# EAGLE design CubePCB_powerControl (EAGLE 9.2.2)
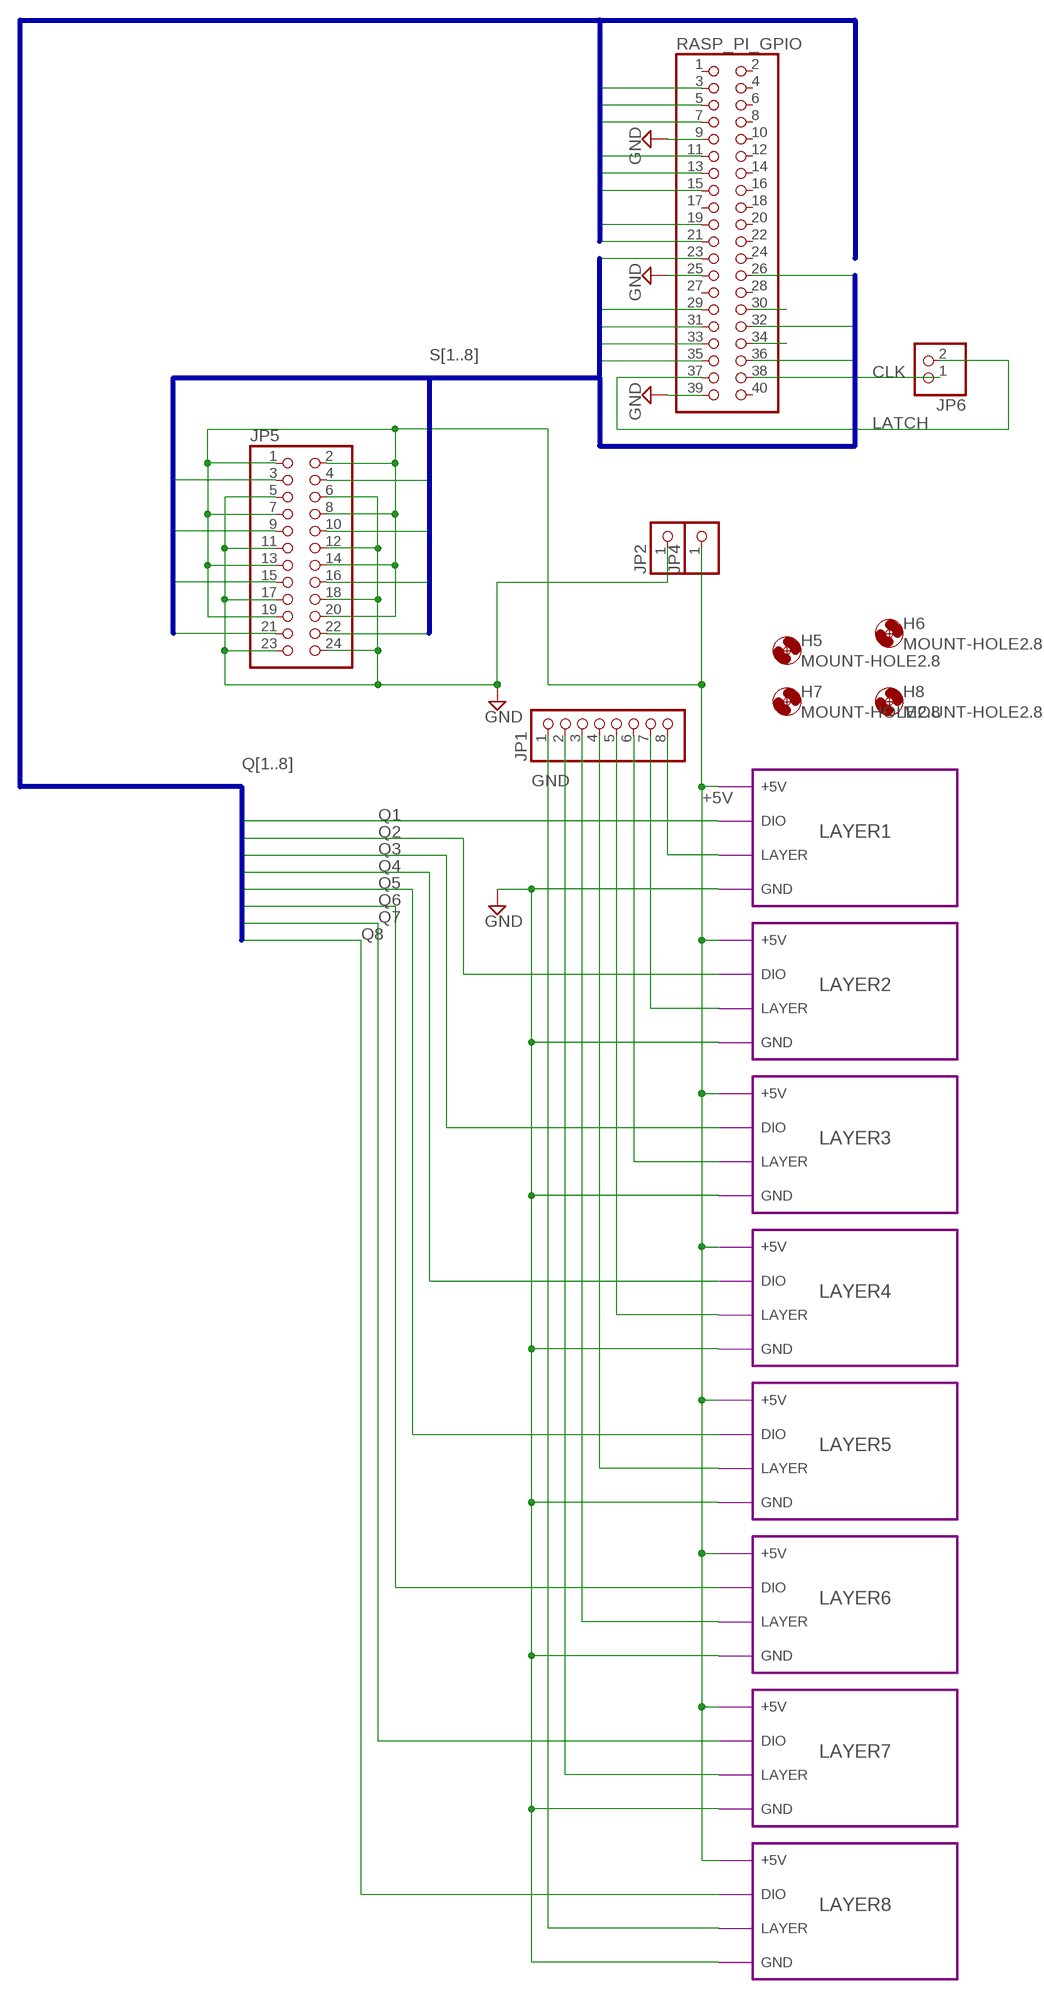
[diagram p0: schematic, sheet 1]

## Parts
H5  MOUNT-HOLE2.8  [2,8]
H6  MOUNT-HOLE2.8  [2,8]
H7  MOUNT-HOLE2.8  [2,8]
H8  MOUNT-HOLE2.8  [2,8]
JP1  PINHD-1X8  [1X08]
JP2  PINHD-1X1  [1X01]
JP4  PINHD-1X1  [1X01]
JP5  PINHD-2X12  [2X12]
JP6  PINHD-1X2  [1X02]
RASP_PI_GPIO  PINHD-2X20  [2X20]

## Module instances
LAYER1 = LAYER
LAYER2 = LAYER
LAYER3 = LAYER
LAYER4 = LAYER
LAYER5 = LAYER
LAYER6 = LAYER
LAYER7 = LAYER
LAYER8 = LAYER

## Nets
+5V: JP4.1 JP5.1 JP5.2 JP5.7 JP5.8 JP5.13 JP5.14 JP5.19 JP5.20 ; port LAYER1.+5V LAYER2.+5V LAYER3.+5V LAYER4.+5V LAYER5.+5V LAYER6.+5V LAYER7.+5V LAYER8.+5V
CLK: JP6.1 RASP_PI_GPIO.38
GND: JP2.1 JP5.5 JP5.6 JP5.11 JP5.12 JP5.17 JP5.18 JP5.23 JP5.24 RASP_PI_GPIO.9 RASP_PI_GPIO.25 RASP_PI_GPIO.39 ; port LAYER8.GND LAYER7.GND LAYER6.GND LAYER5.GND LAYER4.GND LAYER3.GND LAYER2.GND LAYER1.GND
L1: JP1.8 ; port LAYER1.LAYER
L2: JP1.7 ; port LAYER2.LAYER
L3: JP1.6 ; port LAYER3.LAYER
L4: JP1.5 ; port LAYER4.LAYER
L5: JP1.4 ; port LAYER5.LAYER
L6: JP1.3 ; port LAYER6.LAYER
L7: JP1.2 ; port LAYER7.LAYER
L8: JP1.1 ; port LAYER8.LAYER
LATCH: JP6.2 RASP_PI_GPIO.37
N$4: RASP_PI_GPIO.30
N$5: RASP_PI_GPIO.34
Q1: RASP_PI_GPIO.3 ; port LAYER1.DIO
Q2: RASP_PI_GPIO.5 ; port LAYER2.DIO
Q3: RASP_PI_GPIO.7 ; port LAYER3.DIO
Q4: RASP_PI_GPIO.11 ; port LAYER4.DIO
Q5: RASP_PI_GPIO.13 ; port LAYER5.DIO
Q6: RASP_PI_GPIO.15 ; port LAYER6.DIO
Q7: RASP_PI_GPIO.19 ; port LAYER7.DIO
Q8: RASP_PI_GPIO.21 ; port LAYER8.DIO
S1: JP5.3 RASP_PI_GPIO.35
S2: JP5.4 RASP_PI_GPIO.36
S3: JP5.9 RASP_PI_GPIO.32
S4: JP5.10 RASP_PI_GPIO.33
S5: JP5.15 RASP_PI_GPIO.29
S6: JP5.16 RASP_PI_GPIO.31
S7: JP5.21 RASP_PI_GPIO.23
S8: JP5.22 RASP_PI_GPIO.26
Unconnected: RASP_PI_GPIO.1 RASP_PI_GPIO.2 RASP_PI_GPIO.4 RASP_PI_GPIO.6 RASP_PI_GPIO.8 RASP_PI_GPIO.10 RASP_PI_GPIO.12 RASP_PI_GPIO.14 RASP_PI_GPIO.16 RASP_PI_GPIO.17 RASP_PI_GPIO.18 RASP_PI_GPIO.20 RASP_PI_GPIO.22 RASP_PI_GPIO.24 RASP_PI_GPIO.27 RASP_PI_GPIO.28 RASP_PI_GPIO.40

## Buses
Q[1..8]
S[1..8]

## Library data of the parts
H5-H8 = holes:MOUNT-HOLE: MOUNTING HOLE with drill center marker
JP1 = pinhead:PINHD-1X8: PIN HEADER
JP2 JP4 = pinhead:PINHD-1X1: PIN HEADER
JP5 = pinhead:PINHD-2X12: PIN HEADER
JP6 = pinhead:PINHD-1X2: PIN HEADER
RASP_PI_GPIO = pinhead:PINHD-2X20: PIN HEADER

## Module LAYER
Ports: +5V(io) DIO(io) LAYER(io) GND(io)
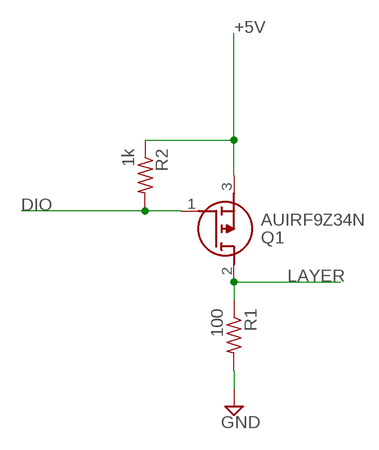
[diagram p1: schematic, module LAYER, sheet 1]

### Parts
Q1  AUIRF9Z34N  [TO254P482X1016X2192-3P]
R1  100  R-US_0204/7  [0204/7]
R2  1k  R-US_0204/7  [0204/7]

### Nets
+5V: Q1.3(S) R2.1
DIO: Q1.1(G) R2.2
GND: R1.2
LAYER: Q1.2(D) R1.1

### Library data of the parts
Q1 = AUIRF9Z34N:AUIRF9Z34N: MOSFET P-Channel 55V 19A TO220AB Infineon AUIRF9Z34N P-channel MOSFET Transistor, 19 A, 55 V, 3-Pin TO-220AB Source: Datasheet <https://www.infineon.com/dgdl/auirf9z34n.pdf?fileId=5546d462533600a4015355b0fd23141c>; ALLIED_NUMBER: 70411560; ALLIED_PRICE-STOCK: https://www.alliedelec.com/infineon-auirf9z34n/70411560/; ARROW_PART_NUMBER: AUIRF9Z34N; ARROW_PRICE-STOCK: https://www.arrow.com/en/products/auirf9z34n/infineon-technologies-ag; DESCRIPTION: MOSFET P-Channel 55V 19A TO220AB Infineon AUIRF9Z34N P-channel MOSFET Transistor, 19 A, 55 V, 3-Pin TO-220AB; HEIGHT: 4.82mm; MANUFACTURER_NAME: Infineon; MANUFACTURER_PART_NUMBER: AUIRF9Z34N; RS_PART_NUMBER: 7481803P; RS_PRICE-STOCK: http://uk.rs-online.com/web/p/products/7481803P
R1 R2 = rcl:R-US_: RESISTOR, American symbol; SPICEPREFIX: R

## Board
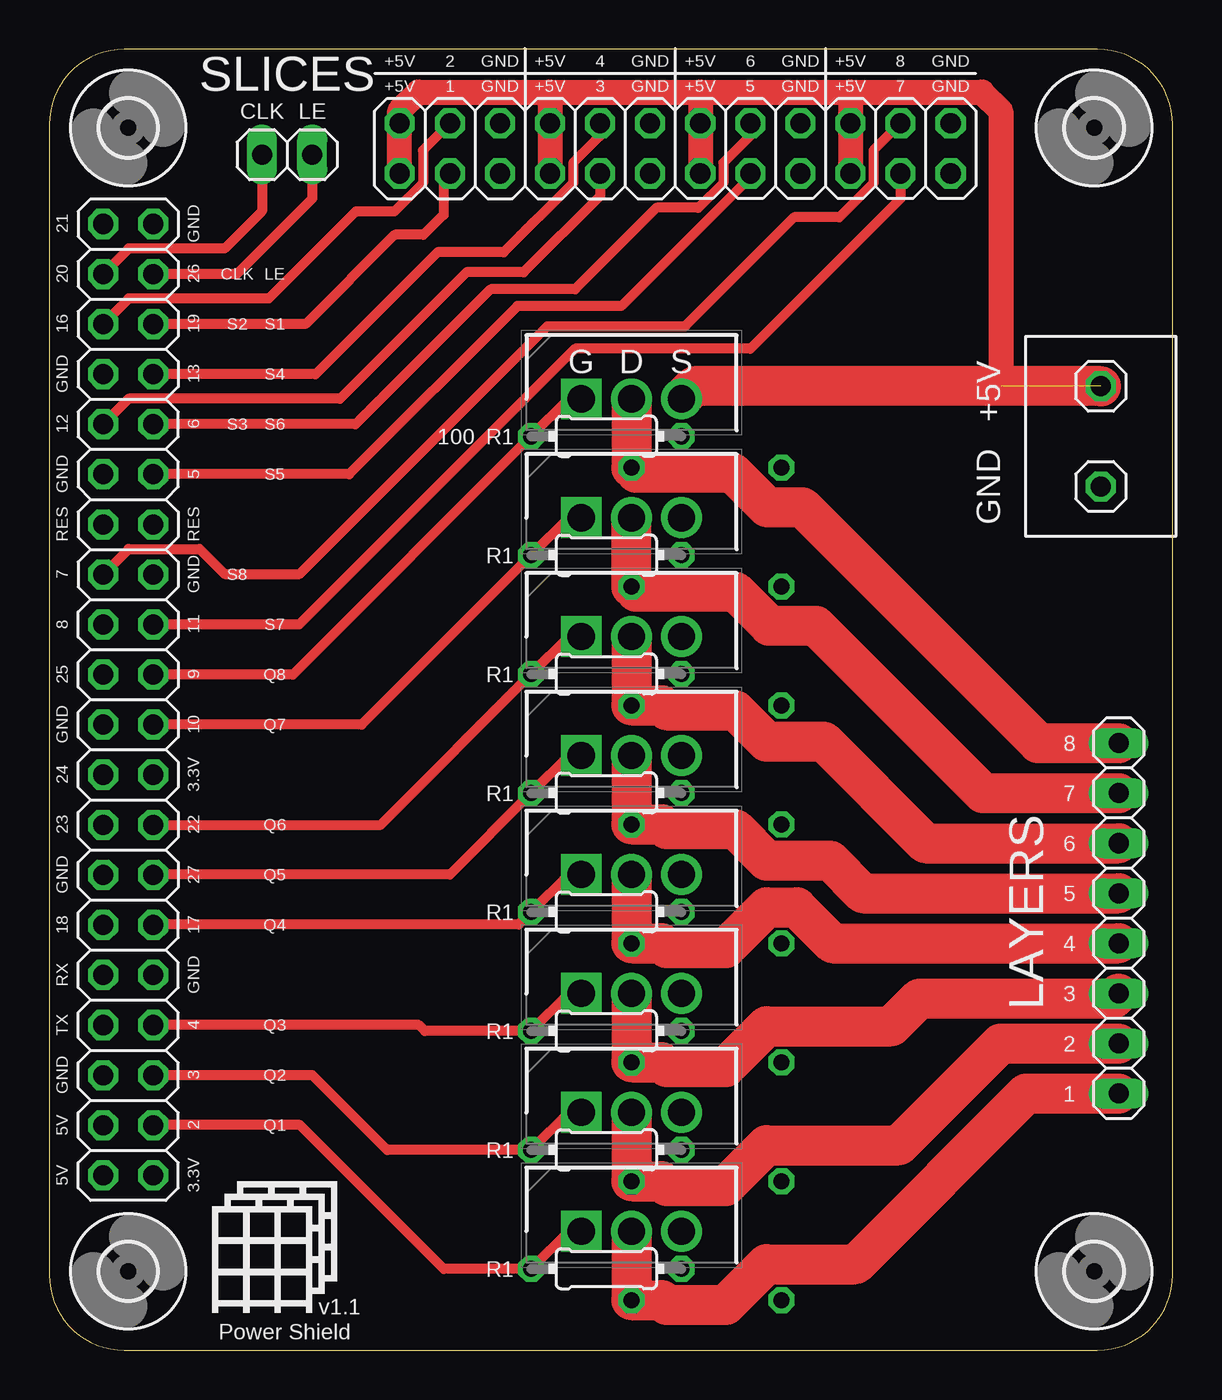
[diagram p2: board, top side]
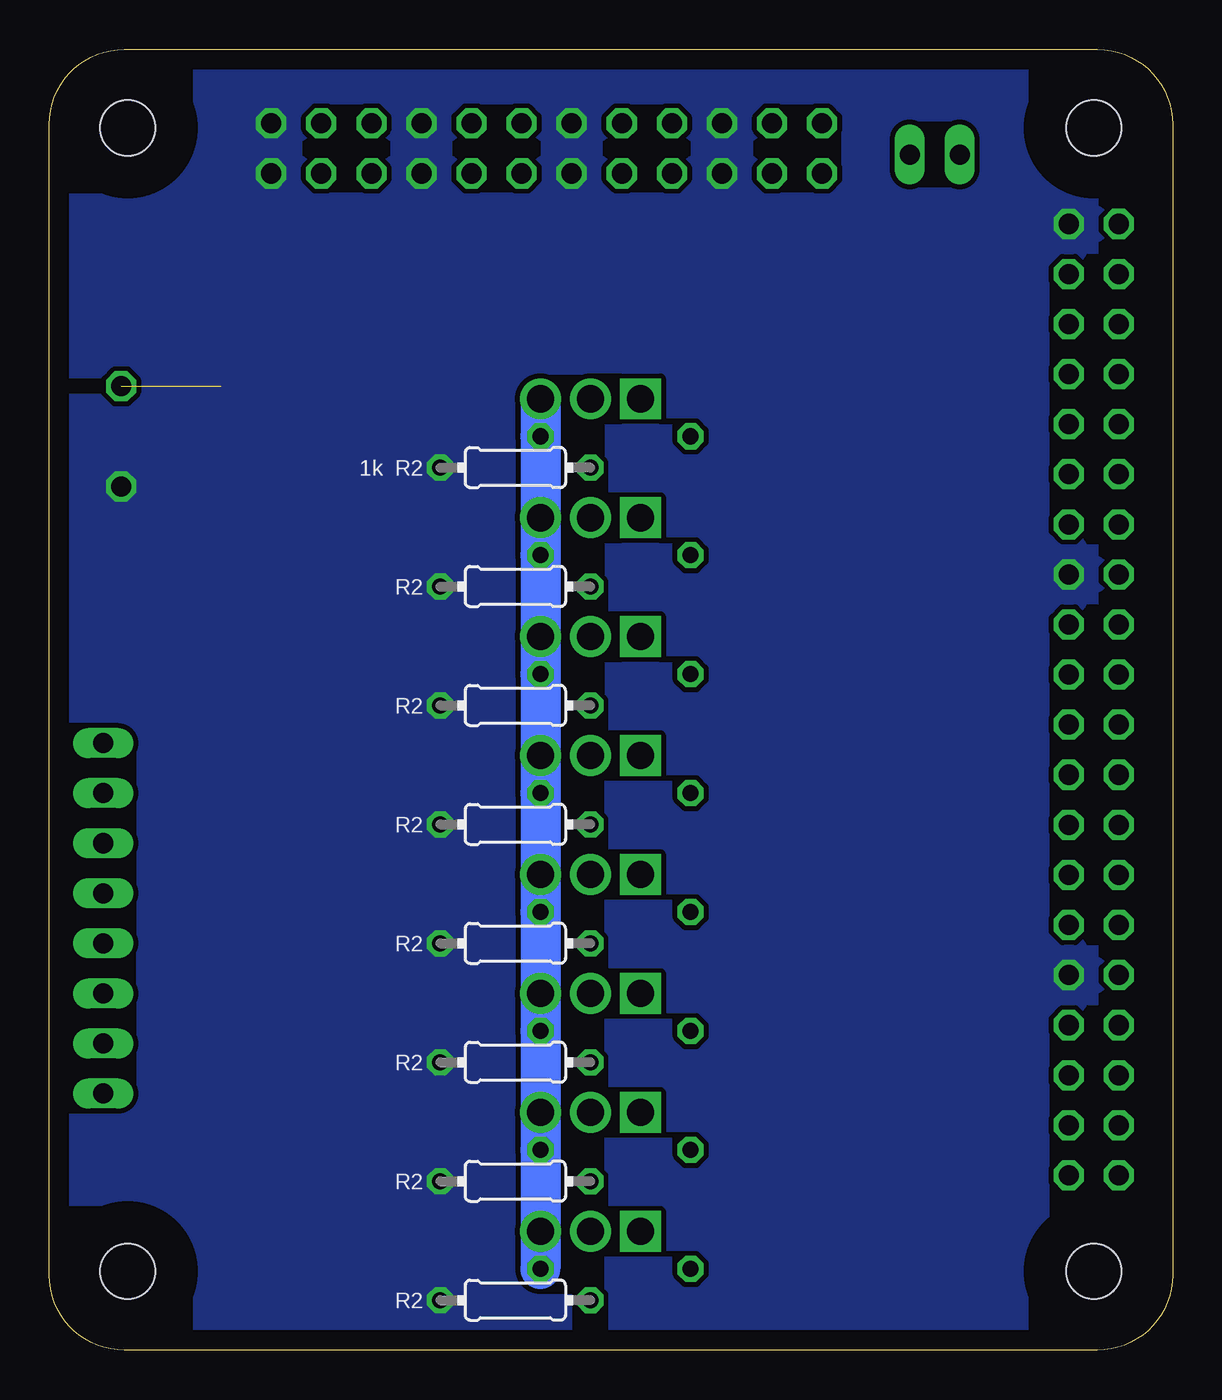
[diagram p3: board, bottom side, seen from below]

Size 56.98 x 65.99 mm. Coordinates in mm from the lower left corner, seen from the top.
Outline: 0,62.18 0,3.81 arc90 3.81,0 53.17,0 arc90 56.98,3.81 56.98,62.18 arc90 53.17,65.99 3.81,65.99 arc90 0,62.18
Copper layers (1*16): Top 0.034796875mm / dielectric 1.5mm / Bottom 0.034796875mm
Design rules "default *": minimum track width 20mil, minimum drill 0.35mm, track to track 10mil, track to pad 6mil, pad to pad 6mil, via to via 6mil, smd to smd 6mil, copper to edge 40mil, drill to drill 6mil, minimum pad ring 10mil, minimum via ring 8mil, stop-mask expansion 4mil, vias tented up to drill 0mil, thermal gap 10mil

### Footprints (pad centres in the part's own frame; a part is rotated, then mirrored left to right if it is on the bottom)
2,8 = hole 2.8: 0,0
1X08 = drill 1.016 long: 1 -8.89,0; 2 -6.35,0; 3 -3.81,0; 4 -1.27,0; 5 1.27,0; 6 3.81,0; 7 6.35,0; 8 8.89,0
1X01 = drill 1.016 octagon: 1 0,0
2X12 = drill 1.016 octagon: 1 -13.97,-1.27; 2 -13.97,1.27; 3 -11.43,-1.27; 4 -11.43,1.27; 5 -8.89,-1.27; 6 -8.89,1.27; 7 -6.35,-1.27; 8 -6.35,1.27; 9 -3.81,-1.27; 10 -3.81,1.27; 11 -1.27,-1.27; 12 -1.27,1.27; 13 1.27,-1.27; 14 1.27,1.27; 15 3.81,-1.27; 16 3.81,1.27; 17 6.35,-1.27; 18 6.35,1.27; 19 8.89,-1.27; 20 8.89,1.27; 21 11.43,-1.27; 22 11.43,1.27; 23 13.97,-1.27; 24 13.97,1.27
1X02 = drill 1.016 long: 1 -1.27,0; 2 1.27,0
TO254P482X1016X2192-3P = drill 1.38 pad 2.07 square: 1 0,0 | drill 1.38 pad 2.07: 2 2.54,0; 3 5.08,0
0204/7 = drill 0.813 octagon: 1 -3.81,0; 2 3.81,0
2X20 = drill 1.016 octagon: 1 -24.13,-1.27; 2 -24.13,1.27; 3 -21.59,-1.27; 4 -21.59,1.27; 5 -19.05,-1.27; 6 -19.05,1.27; 7 -16.51,-1.27; 8 -16.51,1.27; 9 -13.97,-1.27; 10 -13.97,1.27; 11 -11.43,-1.27; 12 -11.43,1.27; 13 -8.89,-1.27; 14 -8.89,1.27; 15 -6.35,-1.27; 16 -6.35,1.27; 17 -3.81,-1.27; 18 -3.81,1.27; 19 -1.27,-1.27; 20 -1.27,1.27; 21 1.27,-1.27; 22 1.27,1.27; 23 3.81,-1.27; 24 3.81,1.27; 25 6.35,-1.27; 26 6.35,1.27; 27 8.89,-1.27; 28 8.89,1.27; 29 11.43,-1.27; 30 11.43,1.27; 31 13.97,-1.27; 32 13.97,1.27; 33 16.51,-1.27; 34 16.51,1.27; 35 19.05,-1.27; 36 19.05,1.27; 37 21.59,-1.27; 38 21.59,1.27; 39 24.13,-1.27; 40 24.13,1.27

### Placement (x,y rotation side)
H5  4,62 0 top
H6  4,4 0 top
H7  53,62 0 top
H8  53,4 0 top
JP1  54.24,21.91 270 top
JP2  53.34,43.81 0 top
JP4  53.34,48.9 0 top
JP5  31.75,60.96 0 top
JP6  12.06,60.64 0 top
LAYER1:Q1  AUIRF9Z34N  [TO254P482X1016X2192-3P]  26.99,6.03 0 top
LAYER1:R1  100  [0204/7]  33.34,2.54 180 bottom
LAYER1:R2  1k  [0204/7]  28.26,4.13 180 top
LAYER2:Q1  AUIRF9Z34N  [TO254P482X1016X2192-3P]  26.99,12.06 0 top
LAYER2:R1  100  [0204/7]  33.34,8.57 180 bottom
LAYER2:R2  1k  [0204/7]  28.26,10.16 180 top
LAYER3:Q1  AUIRF9Z34N  [TO254P482X1016X2192-3P]  26.99,18.1 0 top
LAYER3:R1  100  [0204/7]  33.34,14.61 180 bottom
LAYER3:R2  1k  [0204/7]  28.26,16.19 180 top
LAYER4:Q1  AUIRF9Z34N  [TO254P482X1016X2192-3P]  26.99,24.13 0 top
LAYER4:R1  100  [0204/7]  33.34,20.64 180 bottom
LAYER4:R2  1k  [0204/7]  28.26,22.23 180 top
LAYER5:Q1  AUIRF9Z34N  [TO254P482X1016X2192-3P]  26.99,30.16 0 top
LAYER5:R1  100  [0204/7]  33.34,26.67 180 bottom
LAYER5:R2  1k  [0204/7]  28.26,28.26 180 top
LAYER6:Q1  AUIRF9Z34N  [TO254P482X1016X2192-3P]  26.99,36.2 0 top
LAYER6:R1  100  [0204/7]  33.34,32.7 180 bottom
LAYER6:R2  1k  [0204/7]  28.26,34.29 180 top
LAYER7:Q1  AUIRF9Z34N  [TO254P482X1016X2192-3P]  26.99,42.23 0 top
LAYER7:R1  100  [0204/7]  33.34,38.73 180 bottom
LAYER7:R2  1k  [0204/7]  28.26,40.32 180 top
LAYER8:Q1  AUIRF9Z34N  [TO254P482X1016X2192-3P]  26.99,48.26 0 top
LAYER8:R1  100  [0204/7]  33.34,44.77 180 bottom
LAYER8:R2  1k  [0204/7]  28.26,46.35 180 top
RASP_PI_GPIO  4,33 90 top

### Tracks (layer width: path | path; a pad name or v marks a point on that pad's centre or on a via)
+5V  (1 unrouted)
  Top 1.27: JP5.1 JP5.2 17.78,62.87 18.73,63.82 25.4,63.82 | 25.4,63.82 JP5.8 JP5.7 | 25.4,63.82 33.02,63.82 | 33.02,63.82 JP5.14 JP5.13 | 33.02,63.82 40.62,63.82 | 40.62,63.82 40.64,63.8 JP5.20 JP5.19 | 40.62,63.82 47.31,63.82 48.26,62.87 48.26,48.9
  Top 2.032: JP4.1 32.7,48.9 LAYER8:Q1.3
  Bottom 2.032: LAYER8:Q1.3 LAYER8:R2.1 LAYER7:Q1.3 LAYER7:R2.1 LAYER6:Q1.3 LAYER6:R2.1 LAYER5:Q1.3 LAYER5:R2.1 LAYER4:Q1.3 LAYER4:R2.1 LAYER3:Q1.3 LAYER3:R2.1 LAYER2:Q1.3 LAYER2:R2.1 LAYER1:Q1.3 LAYER1:R2.1
CLK
  Top 0.508: JP6.1 10.79,57.78 8.89,55.88 4.02,55.88 RASP_PI_GPIO.38
GND
  pour Bottom: 0,66.04 0,0 57.42,0 57.42,66.04
L1
  Top 2.032: JP1.8 49.56,13.02 40.91,4.37 36.39,4.37 34.32,2.3 31.31,2.3 31.07,2.54 LAYER1:R1.1 LAYER1:Q1.2
L2
  Top 2.032: JP1.7 48.26,15.56 43.1,10.4 36.39,10.4 34.32,8.33 31.31,8.33 31.07,8.57 LAYER2:R1.1 LAYER2:Q1.2
L3
  Top 2.032: JP1.6 53.99,17.84 44.14,17.84 42.73,16.43 36.39,16.43 34.32,14.36 31.31,14.36 31.07,14.61 LAYER3:R1.1 LAYER3:Q1.2
L4
  Top 2.032: JP1.5 39.73,20.64 37.91,22.47 36.39,22.47 34.32,20.4 31.31,20.4 31.07,20.64 LAYER4:R1.1 LAYER4:Q1.2
L5
  Top 2.032: JP1.4 41.27,23.18 39.61,24.84 36.39,24.84 34.8,26.43 31.31,26.43 31.07,26.67 LAYER5:R1.1 LAYER5:Q1.2
L6
  Top 2.032: JP1.3 44.45,25.72 39.29,30.87 36.39,30.87 34.8,32.46 31.31,32.46 31.07,32.7 LAYER6:R1.1 LAYER6:Q1.2
L7
  Top 2.032: LAYER7:Q1.2 LAYER7:R1.1 29.78,38.48 34.8,38.48 36.53,36.75 38.87,36.75 47.37,28.26 JP1.2
L8
  Top 2.032: LAYER8:Q1.2 LAYER8:R1.1 29.78,44.51 34.66,44.51 36.41,42.76 38.2,42.76 50.16,30.8 JP1.1
LATCH
  Top 0.508: JP6.2 13.34,58.42 9.51,54.59 RASP_PI_GPIO.37
Q1
  Top 0.508: RASP_PI_GPIO.3 5.29,11.43 12.7,11.43 20,4.13 LAYER1:R2.2 26.35,6.03 LAYER1:Q1.1
Q2
  Top 0.508: RASP_PI_GPIO.5 13.36,13.95 17.14,10.16 LAYER2:R2.2 26.35,12.06 LAYER2:Q1.1
Q3
  Top 0.508: LAYER3:Q1.1 26.35,18.1 LAYER3:R2.2 19.05,16.19 18.75,16.49 RASP_PI_GPIO.7
Q4
  Top 0.508: RASP_PI_GPIO.11 5.29,21.59 23.81,21.59 LAYER4:R2.2 26.35,24.13 LAYER4:Q1.1
Q5
  Top 0.508: RASP_PI_GPIO.13 5.29,24.13 20.32,24.13 LAYER5:R2.2 26.35,30.16 LAYER5:Q1.1
Q6
  Top 0.508: RASP_PI_GPIO.15 16.81,26.65 LAYER6:R2.2 26.35,36.2 LAYER6:Q1.1
Q7
  Top 0.508: LAYER7:Q1.1 26.35,42.23 LAYER7:R2.2 15.86,31.73 RASP_PI_GPIO.19
Q8
  Top 0.508: RASP_PI_GPIO.21 12.36,34.27 LAYER8:R2.2 26.35,48.26 LAYER8:Q1.1
S1
  Top 0.508: JP5.3 20,59.37 20,57.59 18.99,56.58 17.53,56.58 13,52.05 RASP_PI_GPIO.35
S2
  Top 0.508: JP5.4 18.95,60.86 18.95,59.21 17.5,57.75 15.54,57.75 11.13,53.34 4.02,53.34 RASP_PI_GPIO.36
S3
  Top 0.508: JP5.9 27.94,58.55 24.07,54.67 21.16,54.67 14.75,48.26 4.02,48.26 RASP_PI_GPIO.32
S4
  Top 0.508: JP5.10 27.94,61.59 26.57,60.22 26.57,59.21 23.05,55.69 19.68,55.69 13.51,49.51 RASP_PI_GPIO.33
S5
  Top 0.508: JP5.15 35.56,59.5 29.02,52.96 23.75,52.96 15.22,44.43 RASP_PI_GPIO.29
S6
  Top 0.508: JP5.16 35.56,61.59 34.19,60.22 34.19,59.21 32.93,57.94 30.8,57.94 26.67,53.82 22.38,53.82 15.54,46.97 RASP_PI_GPIO.31
S7
  Top 0.508: RASP_PI_GPIO.23 12.68,36.81 26.67,50.8 35.56,50.8 43.18,58.42 JP5.21
S8
  Top 0.508: JP5.22 41.81,60.86 41.81,59.21 40.07,57.47 37.78,57.47 32.26,51.94 25.27,51.94 12.7,39.37 8.89,39.37 7.62,40.64 4.02,40.64 RASP_PI_GPIO.26

### Text on the board
tNames: SLICES | +5V | 2 | GND | +5V | 4 | GND | +5V | 6 | GND | +5V | 8 | GND | +5V | 1 | GND | +5V | 3 | GND | +5V | 5 | GND | +5V | 7 | GND | CLK | LE | 21 | GND | 20 | 26 | CLK | LE | 16 | 19 | S2 | S1 | GND | 13 | S4 | G | D | S | +5V | 12 | 6 | S3 | S6 | 100 | R1 | GND | 5 | S5 | GND | RES | RES | R1 | 7 | GND | S8 | 8 | 11 | S7 | 25 | 9 | Q8 | R1 | GND | 10 | Q7 | 8 | 24 | 3.3V | R1 | 7 | 23 | 22 | Q6 | 6 | GND | 27 | Q5 | 5 | 18 | 17 | Q4 | R1 | LAYERS | 4 | RX | GND | 3 | TX | 4 | Q3 | R1 | 2 | GND | 3 | Q2 | 1 | 5V | 2 | Q1 | R1 | 5V | 3.3V | R1 | v1.1 | Power Shield
bNames: R2 | 1k | R2 | R2 | R2 | R2 | R2 | R2 | R2